# EAGLE schematic 140715_AriloTX_REV2_1_0 (EAGLE 6.5.0)
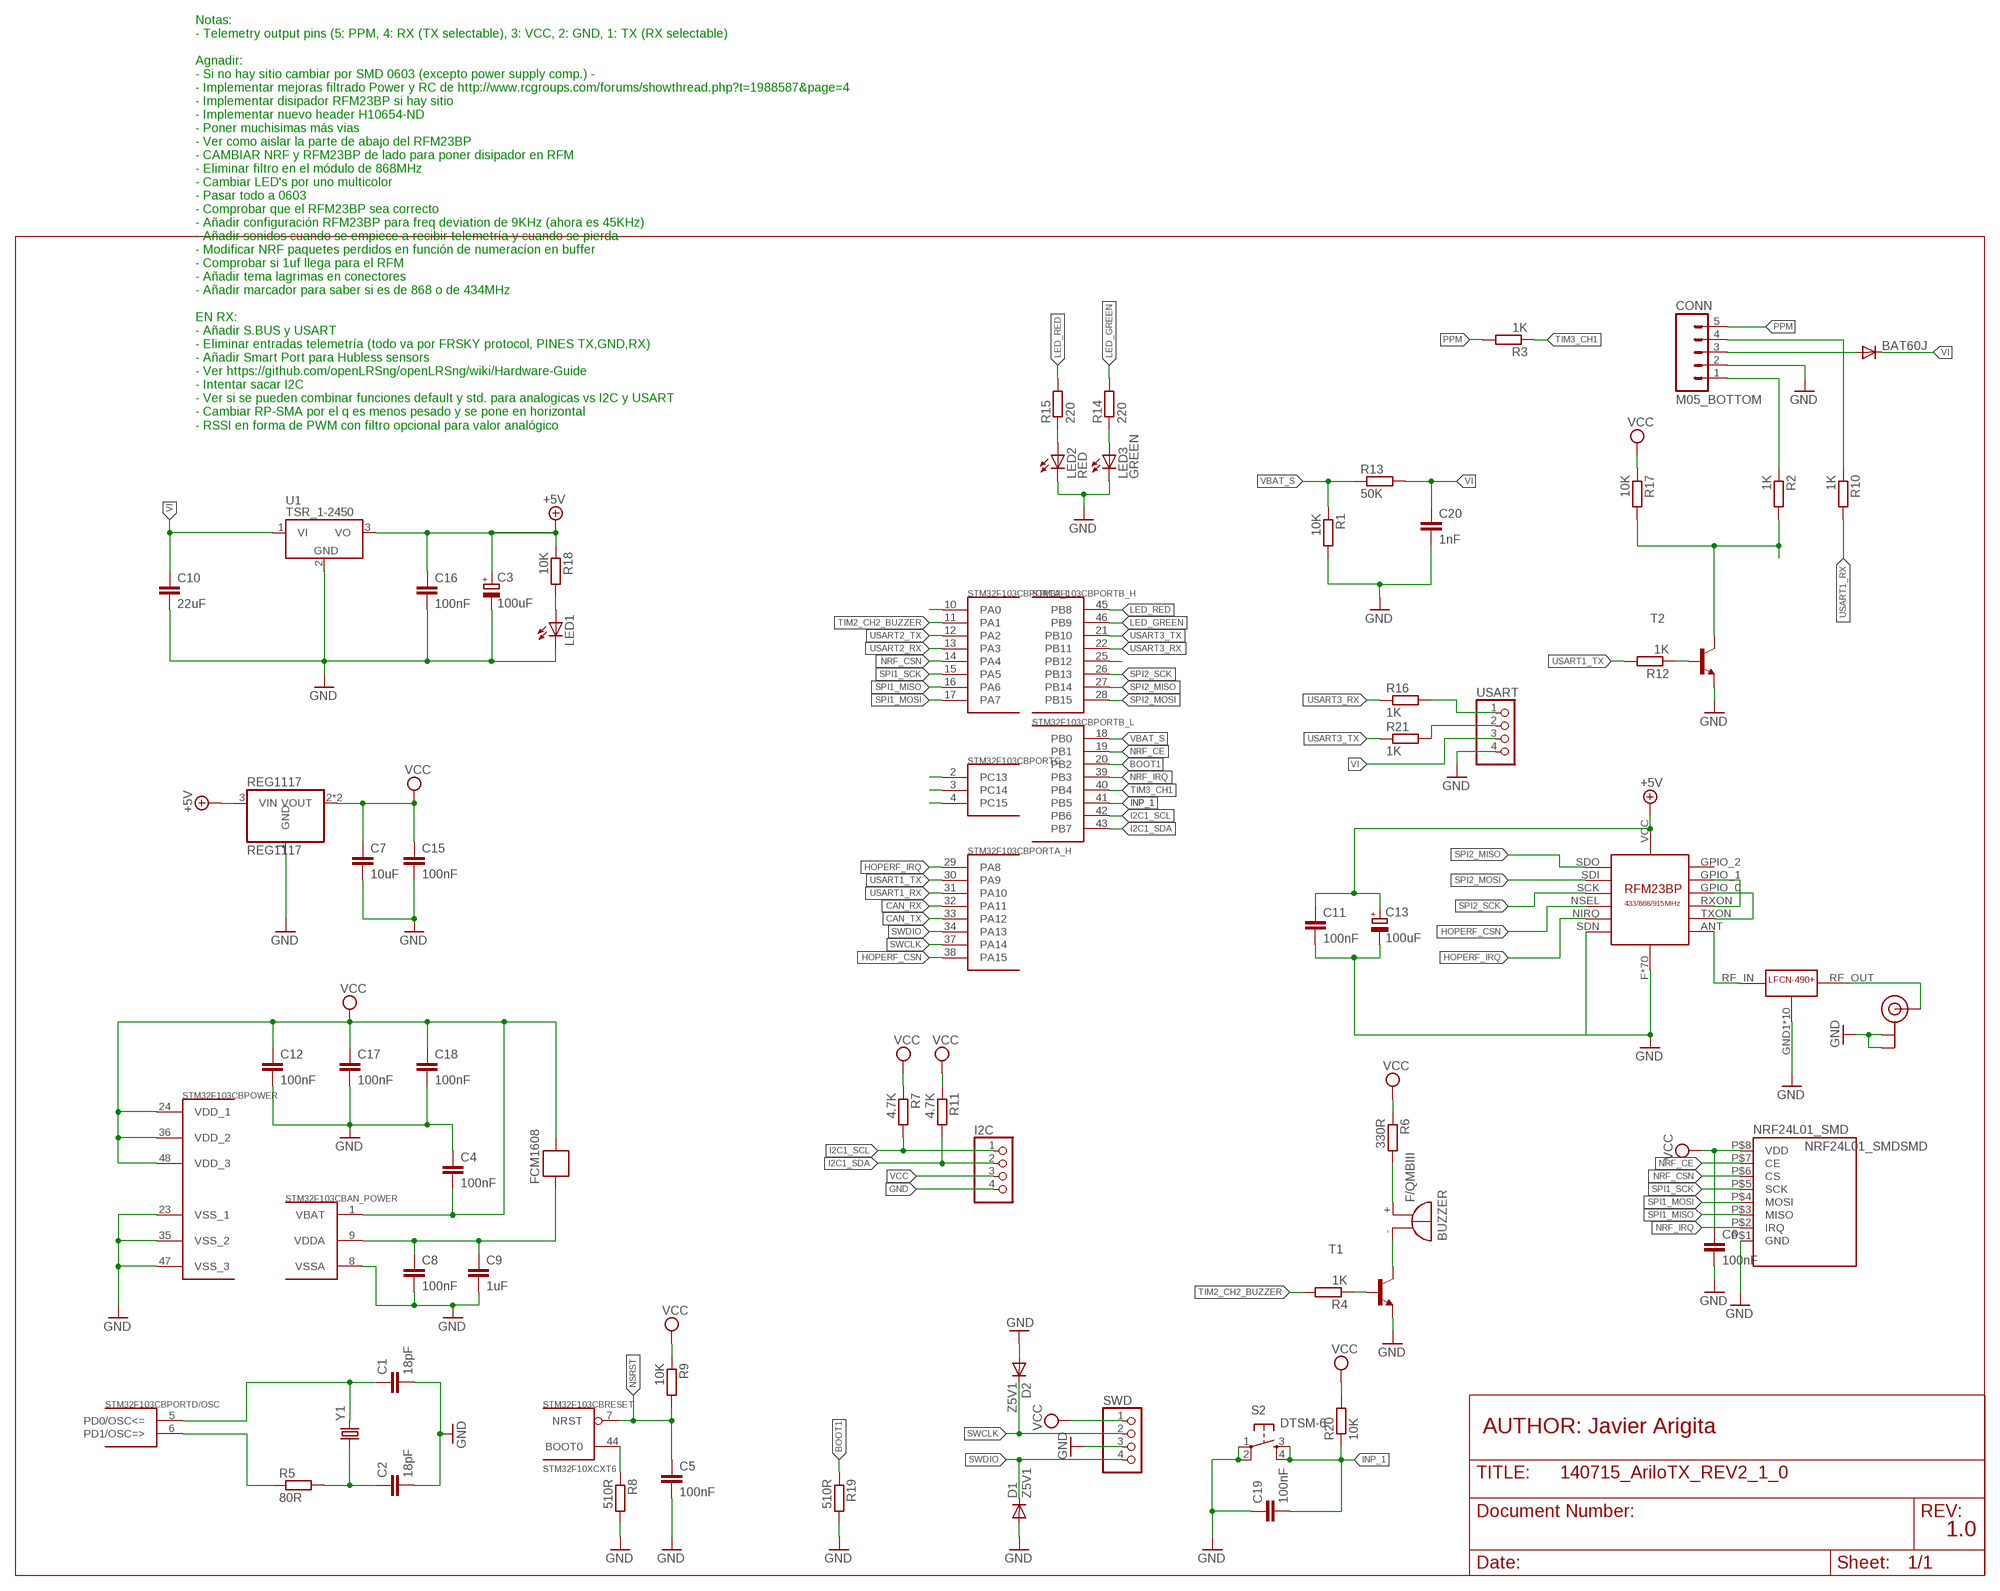
[diagram p0: schematic, sheet 1]

## Parts
BAT60J  DIODE-SOD323-R  [SOD323-R]
BUZZER  F/QMBIII  [F/QMBIII]
C1  18pF  C-EUC0603  [C0603]
C2  18pF  C-EUC0603  [C0603]
C3  100uF  CPOL-EUSMCB  [SMC_B]
C4  100nF  C-EUC0603  [C0603]
C5  100nF  C-EUC0603  [C0603]
C6  100nF  C-EUC0603  [C0603]
C7  10uF  C-EUC0805  [C0805]
C8  100nF  C-EUC0603  [C0603]
C9  1uF  C-EUC0603  [C0603]
C10  22uF  C-EUC3216  [C3216]
C11  100nF  C-EUC0603  [C0603]
C12  100nF  C-EUC0603  [C0603]
C13  100uF  CPOL-EUSMCB  [SMC_B]
C15  100nF  C-EUC0603  [C0603]
C16  100nF  C-EUC0603  [C0603]
C17  100nF  C-EUC0603  [C0603]
C18  100nF  C-EUC0603  [C0603]
C19  100nF  C-EUC0603  [C0603]
C20  1nF  C-EUC0603  [C0603]
CONN  M05_BOTTOM  [M05_BOTTOM]
D1  Z5V1  DIODE-SOD323-R  [SOD323-R]
D2  Z5V1  DIODE-SOD323-R  [SOD323-R]
FCM1608  FERRITE-BEAD  [R0603]
I2C  PINHD-1X4  [1X04]
LED1  LEDCHIP-LED0603  [CHIP-LED0603]
LED2  RED  LEDCHIP-LED0603  [CHIP-LED0603]
LED3  GREEN  LEDCHIP-LED0603  [CHIP-LED0603]
NRF24L01_SMD  NRF24L01_SMDSMD  [NRF24L01_SMD]
R1  10K  R-EU_R0603  [R0603]
R2  1K  R-EU_R0603  [R0603]
R3  1K  R-EU_R0603  [R0603]
R4  1K  R-EU_R0603  [R0603]
R5  80R  R-EU_R0603  [R0603]
R6  330R  R-EU_R0603  [R0603]
R7  4.7K  R-EU_R0603  [R0603]
R8  510R  R-EU_R0603  [R0603]
R9  10K  R-EU_R0603  [R0603]
R10  1K  R-EU_R0603  [R0603]
R11  4.7K  R-EU_R0603  [R0603]
R12  1K  R-EU_R0603  [R0603]
R13  50K  R-EU_R0603  [R0603]
R14  220  R-EU_R0603  [R0603]
R15  220  R-EU_R0603  [R0603]
R16  1K  R-EU_R0603  [R0603]
R17  10K  R-EU_R0603  [R0603]
R18  10K  R-EU_R0603  [R0603]
R19  510R  R-EU_R0603  [R0603]
R20  10K  R-EU_R0603  [R0603]
R21  1K  R-EU_R0603  [R0603]
REG1117  REG1117  [SOT223]
S2  DTSM-6  [DTSM-6]
STM32F103CB  STM32F10XCXT6  [TQFP48]
SWD  PINHD-1X4  [1X04]
T1  BC848-NPN-SOT23-BEC  [SOT23-BEC]
T2  BC848-NPN-SOT23-BEC  [SOT23-BEC]
U1  TSR_1-2450  [TSR-1]
U$1  RFM23BP  [RFM23BP]
U$2  LFCN490+  [LFCN490+]
U$3  U.FL  [U.FL]
USART  PINHD-1X4  [1X04]
Y1  CRYSTAL5X3  [CRYSTAL-SMD-5X3]

## Nets
+5V: C3.+ C11.1 C13.+ C16.1 R18.1 REG1117.3(VIN) U1.3(VO) U$1.VCC
BOOT1: R19.1 STM32F103CB.20(PORTB_L:PB2)
CAN_RX: STM32F103CB.32(PORTA_H:PA11)
CAN_TX: STM32F103CB.33(PORTA_H:PA12)
GND: C1.2 C2.2 C3.- C4.1 C5.2 C6.2 C7.2 C8.2 C9.2 C10.2 C11.2 C12.2 C13.- C15.2 C16.2 C17.2 C18.2 C19.1 C20.2 CONN.2 D1.A D2.A I2C.4 LED1.C LED2.C LED3.C NRF24L01_SMD.P$1(GND) R1.2 R8.2 R19.2 REG1117.1(GND) S2.1 S2.2 STM32F103CB.8(AN_POWER:VSSA) STM32F103CB.23(POWER:VSS_1) STM32F103CB.35(POWER:VSS_2) STM32F103CB.47(POWER:VSS_3) SWD.3 T1.E T2.E U1.2(GND) U$1.F1(GND) U$1.F2(GND) U$1.F3(GND) U$1.F4(GND) U$1.F5(GND) U$1.F6(GND) U$1.F7(GND) U$1.F8(GND) U$1.F9(GND) U$1.F10(GND) U$1.F11(GND) U$1.F12(GND) U$1.F13(GND) U$1.F14(GND) U$1.F15(GND) U$1.F16(GND) U$1.F17(GND) U$1.F18(GND) U$1.F19(GND) U$1.F20(GND) U$1.F21(GND) U$1.F22(GND) U$1.F23(GND) U$1.F24(GND) U$1.F25(GND) U$1.F26(GND) U$1.F27(GND) U$1.F28(GND) U$1.F29(GND) U$1.F30(GND) U$1.F31(GND) U$1.F32(GND) U$1.F33(GND) U$1.F34(GND) U$1.F35(GND) U$1.F36(GND) U$1.F37(GND) U$1.F38(GND) U$1.F39(GND) U$1.F40(GND) U$1.F41(GND) U$1.F42(GND) U$1.F43(GND) U$1.F44(GND) U$1.F45(GND) U$1.F46(GND) U$1.F47(GND) U$1.F48(GND) U$1.F49(GND) U$1.F50(GND) U$1.F51(GND) U$1.F52(GND) U$1.F53(GND) U$1.F54(GND) U$1.F55(GND) U$1.F56(GND) U$1.F57(GND) U$1.F58(GND) U$1.F59(GND) U$1.F60(GND) U$1.F61(GND) U$1.F62(GND) U$1.F63(GND) U$1.F64(GND) U$1.F65(GND) U$1.F(GND) U$1.GND1(GND) U$1.GND2(GND) U$1.GND3(GND) U$1.GND_HEAT(GND) U$1.SDN U$2.GND1(GND) U$2.GND2(GND) U$2.GND3(GND) U$2.GND4(GND) U$2.GND5(GND) U$2.GND6(GND) U$2.GND7(GND) U$2.GND8(GND) U$2.GND9(GND) U$2.GND10(GND) U$3.P$1(GND) U$3.P$2(GND) USART.4
HOPERF_CSN: STM32F103CB.38(PORTA_H:PA15) U$1.NSEL
HOPERF_IRQ: STM32F103CB.29(PORTA_H:PA8) U$1.NIRQ
I2C1_SCL: I2C.1 R7.2 STM32F103CB.42(PORTB_L:PB6)
I2C1_SDA: I2C.2 R11.2 STM32F103CB.43(PORTB_L:PB7)
INP_1: C19.2 R20.1 S2.3 S2.4 STM32F103CB.41(PORTB_L:PB5)
LED_GREEN: R14.2 STM32F103CB.46(PORTB_H:PB9)
LED_RED: R15.2 STM32F103CB.45(PORTB_H:PB8)
N$1: C1.1 STM32F103CB.5(PORTD/OSC:PD0/OSC<=) Y1.3
N$2: R5.1 STM32F103CB.6(PORTD/OSC:PD1/OSC=>)
N$3: C2.1 R5.2 Y1.1
N$4: R8.1 STM32F103CB.44(RESET:BOOT0)
N$5: R12.1 T2.B
N$6: CONN.1 R2.1
N$7: LED2.A R15.1
N$8: LED3.A R14.1
N$9: CONN.4 R10.1
N$10: LED1.A R18.2
N$11: U$1.ANT U$2.RF_IN(RF_INP)
N$12: R16.2 USART.1
N$13: R21.2 USART.2
N$14: BAT60J.A CONN.3
N$15: STM32F103CB.2(PORTC:PC13)
N$16: BUZZER.+(-) R6.2
N$17: C8.1 C9.1 FCM1608.2 STM32F103CB.9(AN_POWER:VDDA)
N$18: STM32F103CB.3(PORTC:PC14)
N$19: STM32F103CB.4(PORTC:PC15)
N$20: U$2.RF_OUT(RF_OUTP) U$3.P$3(SIGNAL)
N$21: R4.1 T1.B
N$22: STM32F103CB.25(PORTB_H:PB12)
N$23: BUZZER.-(+) T1.C
N$24: STM32F103CB.10(PORTA_L:PA0)
N$25: U$1.GPIO_1 U$1.RXON
N$26: U$1.GPIO_0 U$1.TXON
NRF_CE: NRF24L01_SMD.P$7(CE) STM32F103CB.19(PORTB_L:PB1)
NRF_CSN: NRF24L01_SMD.P$6(CS) STM32F103CB.14(PORTA_L:PA4)
NRF_IRQ: NRF24L01_SMD.P$2(IRQ) STM32F103CB.39(PORTB_L:PB3)
NSRST: C5.1 R9.2 STM32F103CB.7(RESET:NRST)
PPM: CONN.5 R3.2
SPI1_MISO: NRF24L01_SMD.P$3(MISO) STM32F103CB.16(PORTA_L:PA6)
SPI1_MOSI: NRF24L01_SMD.P$4(MOSI) STM32F103CB.17(PORTA_L:PA7)
SPI1_SCK: NRF24L01_SMD.P$5(SCK) STM32F103CB.15(PORTA_L:PA5)
SPI2_MISO: STM32F103CB.27(PORTB_H:PB14) U$1.SDO
SPI2_MOSI: STM32F103CB.28(PORTB_H:PB15) U$1.SDI
SPI2_SCK: STM32F103CB.26(PORTB_H:PB13) U$1.SCK
SWCLK: D2.C STM32F103CB.37(PORTA_H:PA14) SWD.2
SWDIO: D1.C STM32F103CB.34(PORTA_H:PA13) SWD.4
TIM2_CH2_BUZZER: R4.2 STM32F103CB.11(PORTA_L:PA1)
TIM3_CH1: R3.1 STM32F103CB.40(PORTB_L:PB4)
USART1_RX: R10.2 STM32F103CB.31(PORTA_H:PA10)
USART1_TX: R2.2 R12.2 R17.2 STM32F103CB.30(PORTA_H:PA9) T2.C
USART2_RX: STM32F103CB.13(PORTA_L:PA3)
USART2_TX: STM32F103CB.12(PORTA_L:PA2)
USART3_RX: R16.1 STM32F103CB.22(PORTB_H:PB11)
USART3_TX: R21.1 STM32F103CB.21(PORTB_H:PB10)
VBAT_S: R1.1 R13.1 STM32F103CB.18(PORTB_L:PB0)
VCC: C4.2 C6.1 C7.1 C12.1 C15.1 C17.1 C18.1 FCM1608.1 I2C.3 NRF24L01_SMD.P$8(VDD) R6.1 R7.1 R9.1 R11.1 R17.1 R20.2 REG1117.2(VOUT) REG1117.4(VOUT) STM32F103CB.1(AN_POWER:VBAT) STM32F103CB.24(POWER:VDD_1) STM32F103CB.36(POWER:VDD_2) STM32F103CB.48(POWER:VDD_3) SWD.1
VI: BAT60J.C C10.1 C20.1 R13.2 U1.1(VI) USART.3
Unconnected: U$1.GPIO_2

## Notes on the sheet
- Notas: 
  - Telemetry output pins (5: PPM, 4: RX (TX selectable), 3: VCC, 2: GND, 1: TX (RX selectable)
  
  Agnadir: 
  - Si no hay sitio cambiar por SMD 0603 (excepto power supply comp.) - 
  - Implementar mejoras filtrado Power y RC de http://www.rcgroups.com/forums/showthread.php?t=1988587&page=4 
  - Implementar disipador RFM23BP si hay sitio
  - Implementar nuevo header H10654-ND
  - Poner muchisimas más vias
  - Ver como aislar la parte de abajo del RFM23BP
  - CAMBIAR NRF y RFM23BP de lado para poner disipador en RFM
  - Eliminar filtro en el módulo de 868MHz
  - Cambiar LED's por uno multicolor
  - Pasar todo a 0603
  - Comprobar que el RFM23BP sea correcto
  - Añadir configuración RFM23BP para freq deviation de 9KHz (ahora es 45KHz)
  - Añadir sonidos cuando se empiece a recibir telemetría y cuando se pierda
  - Modificar NRF paquetes perdidos en función de numeracíon en buffer
  - Comprobar si 1uf llega para el RFM
  - Añadir tema lagrimas en conectores
  - Añadir marcador para saber si es de 868 o de 434MHz
  
  EN RX:
  - Añadir S.BUS y USART
  - Eliminar entradas telemetría (todo va por FRSKY protocol, PINES TX,GND,RX)
  - Añadir Smart Port para Hubless sensors
  - Ver https://github.com/openLRSng/openLRSng/wiki/Hardware-Guide
  - Intentar sacar I2C
  - Ver si se pueden combinar funciones default y std. para analogicas vs I2C y USART
  - Cambiar RP-SMA por el q es menos pesado y se pone en horizontal
  - RSSI en forma de PWM con filtro opcional para valor analógico
- AUTHOR: Javier Arigita
- 1.0

## Library data of the parts
BAT60J D1 D2 = diode:DIODE-: DIODE
BUZZER = buzzer:F/QMBIII: BUZZER Source: Buerklin; OC_FARNELL: unknown; OC_NEWARK: unknown
C1 C2 C4-C9 C11 C12 C15-C20 = rcl:C-EU: CAPACITOR, European symbol
C3 C13 = rcl:CPOL-EU: POLARIZED CAPACITOR, European symbol
C10 = resistor:C-EU: CAPACITOR, European symbol
CONN = RFM23BP_new:M05_BOTTOM
FCM1608 = BaseApp:FERRITE-BEAD
I2C SWD USART = pinhead:PINHD-1X4: PIN HEADER
LED1-LED3 = led:LED: LED OSRAM: - CHIPLED LG R971, LG N971, LY N971, LG Q971, LY Q971, LO R971, LY R971 LH N974, LH R974 LS Q976, LO Q976, LY Q976 LO Q996 - Hyper CHIPLED LW Q18S LB Q993, LB Q99A, LB R99A - SideLED LS A670, LO A670, LY A670, LG A670, LP A670 LB A673, LV A673, LT A673, LW A673 LH A674 LY A675 LS A676, LA A676, LO A676, LY A676, LW A676 LS A679, LY A679, LG A679 - Hyper Micro SIDELED® LS Y876, LA Y876, LO Y876, LY Y876 LT Y87S - SmartLED LW L88C, LW L88S LB L89C, LB L89S, LG L890 LS L89K, LO L89K, LY L89K LS L896, LA L896, LO L896, LY L896 - TOPLED LS T670, LO T670, LY T670, LG T670, LP T670 LSG T670, LSP T670, LSY T670, LOP T670, LYG T670 LG T671, LOG T671, LSG T671 LB T673, LV T673, LT T673, LW T673 LH T674 LS T676, LA T676, LO T676, LY T676, LB T676, LH T676, LSB T676, LW T676 LB T67C, LV T67C, LT T67C, LS T67K, LO T67K, LY T67K, LW E67C LS E67B, LA E67B, LO E67B, LY E67B, LB E67C, LV E67C, LT E67C LW T67C LS T679, LY T679, LG T679 LS T770, LO T770, LY T770, LG T770, LP T770 LB T773, LV T773, LT T773, LW T773 LH T774 LS E675, LA E675, LY E675, LS T675 LS T776, LA T776, LO T776, LY T776, LB T776 LHGB T686 LT T68C, LB T68C - Hyper Mini TOPLED® LB M676 - Mini TOPLED Santana® LG M470 LS M47K, LO M47K, LY M47K Source: http://www.osram.convergy.de LUXEON: - LUMILED® LXK2-PW12-R00, LXK2-PW12-S00, LXK2-PW14-U00, LXK2-PW14-V00 LXK2-PM12-R00, LXK2-PM12-S00, LXK2-PM14-U00 LXK2-PE12-Q00, LXK2-PE12-R00, LXK2-PE12-S00, LXK2-PE14-T00, LXK2-PE14-U00 LXK2-PB12-K00, LXK2-PB12-L00, LXK2-PB12-M00, LXK2-PB14-N00, LXK2-PB14-P00, LXK2-PB14-Q00 LXK2-PR12-L00, LXK2-PR12-M00, LXK2-PR14-Q00, LXK2-PR14-R00 LXK2-PD12-Q00, LXK2-PD12-R00, LXK2-PD12-S00 LXK2-PH12-R00, LXK2-PH12-S00 LXK2-PL12-P00, LXK2-PL12-Q00, LXK2-PL12-R00 Source: www.luxeon.com KINGBRIGHT: KA-3528ASYC Source: www.kingbright.com
NRF24L01_SMD = NRF24L01+:NRF24L01_SMD
R1-R21 = rcl:R-EU_: RESISTOR, European symbol
REG1117 = CEDT:REG1117: 800mA and 1A Low Dropout (LDO) Positive Regulator 1.8V, 2.5V, 2.85V, 3.3V, 5V, and Adj
S2 = switch-tact:DTSM-6
STM32F103CB = stm32:STM32F10XCXT6: ST STM32F101/103 48pin LQFP
T1 T2 = transistor:*-NPN-: NPN Transistror BF959 corrected 2008.03.06
U1 = _hhn_traco_tsr-1:TSR_1-*: TRACO TSR-1 Series Point-of-Load DC/DC-Converters Vi max. 36 V; Vo = (1.2 .. 15)V ±2%; Io = 0 .. 1 A SIP-Package (drop-in replacement for 78xx linear voltage regulators in TO220-package, vertically assembled) Source: www.tracopower.com Technologies: TSR 1- Vi (V) Vo (V) ±2% Io = 0 .. 1 A 24_ ( generic ) 2412 4.6 .. 36 1.2 2415 4.6 .. 36 1.5 2418 4.6 .. 36 1.8 2425 4.6 .. 36 2.5 2433 4.75.. 36 3.3 2450 6.5 .. 36 5.0 2465 9.0 .. 36 6.5 2490 12 .. 36 9.0 24120 15 .. 36 12 24150 18 .. 36 15 Author: Dipl.-Ing. FH Rainer Bayer HHN Hochschule Heilbronn, rainer.bayer@hs-heilbronn.de Ingenieurbüro ing-rb, mail@ing-rb.de
U$1 = RFM23BP:RFM23BP: HopeRF RFM23BP Library by: http://projects.weber-itam.de
U$2 = RFM23BP:LFCN490+
U$3 = SparkFun-Connectors:U.FL: SMD antenna connector- WRL-09144
Y1 = SparkFun-FreqCtrl:CRYSTAL: Various standard crystals. Proven footprints. Spark Fun Electronics SKU : COM-00534